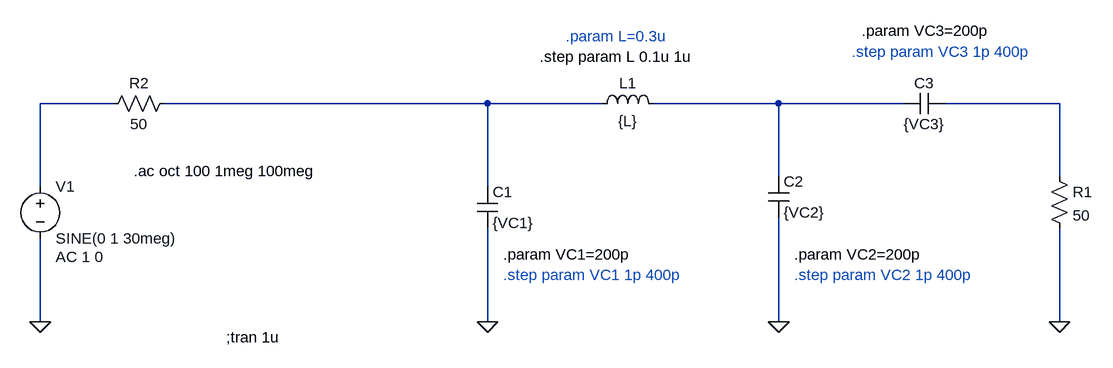
[diagram p0: schematic ANT Coupler.asc]
ANT Coupler.asc, the LTspice schematic file:
Version 4
SHEET 1 1160 680
WIRE -448 -48 -560 -48
WIRE 128 -48 -368 -48
WIRE 304 -48 128 -48
WIRE 576 -48 384 -48
WIRE 768 -48 576 -48
WIRE 1008 -48 832 -48
WIRE 576 64 576 -48
WIRE 1008 64 1008 -48
WIRE -560 80 -560 -48
WIRE 128 80 128 -48
WIRE -560 288 -560 160
WIRE 128 288 128 144
WIRE 576 288 576 128
WIRE 1008 288 1008 144
FLAG 128 288 0
FLAG -560 288 0
FLAG 576 288 0
FLAG 1008 288 0
SYMBOL voltage -560 64 R0
WINDOW 123 24 124 Left 2
WINDOW 39 0 0 Left 2
SYMATTR InstName V1
SYMATTR Value SINE(0 1 30meg)
SYMATTR Value2 AC 1 0
SYMBOL ind 288 -32 R270
WINDOW 0 32 56 VTop 2
WINDOW 3 5 56 VBottom 2
SYMATTR InstName L1
SYMATTR Value {L}
SYMBOL res 992 48 R0
SYMATTR InstName R1
SYMATTR Value 50
SYMBOL res -352 -64 R90
WINDOW 0 0 56 VBottom 2
WINDOW 3 32 56 VTop 2
SYMATTR InstName R2
SYMATTR Value 50
SYMBOL cap 112 80 R0
SYMATTR InstName C1
SYMATTR Value {VC1}
SYMBOL cap 560 64 R0
SYMATTR InstName C2
SYMATTR Value {VC2}
SYMBOL cap 768 -64 M90
WINDOW 0 0 32 VBottom 2
WINDOW 3 32 32 VTop 2
SYMATTR InstName C3
SYMATTR Value {VC3}
TEXT -274 312 Left 2 !;tran 1u
TEXT -416 56 Left 2 !.ac oct 100 1meg 100meg
TEXT 600 184 Left 2 !.param VC2=200p
TEXT 152 184 Left 2 !.param VC1=200p
TEXT 248 -152 Left 2 ;.param L=0.3u
TEXT 688 -128 Left 2 ;.step param VC3 1p 400p
TEXT 600 216 Left 2 ;.step param VC2 1p 400p
TEXT 704 -160 Left 2 !.param VC3=200p
TEXT 152 216 Left 2 ;.step param VC1 1p 400p
TEXT 208 -120 Left 2 !.step param L 0.1u 1u

The netlist it stands for:
* ANT Coupler.asc
V1 N001 0 SINE(0 1 30meg) AC 1 0
L1 N002 N003 {L}
R1 N004 0 50
R2 N002 N001 50
C1 N002 0 {VC1}
C2 N003 0 {VC2}
C3 N003 N004 {VC3}
;tran 1u
.ac oct 100 1meg 100meg
.param VC2=200p
.param VC1=200p
* .param L=0.3u
* .step param VC3 1p 400p
* .step param VC2 1p 400p
.param VC3=200p
* .step param VC1 1p 400p
.step param L 0.1u 1u
.backanno
.end